# EAGLE design biggity (EAGLE 9.1.1)
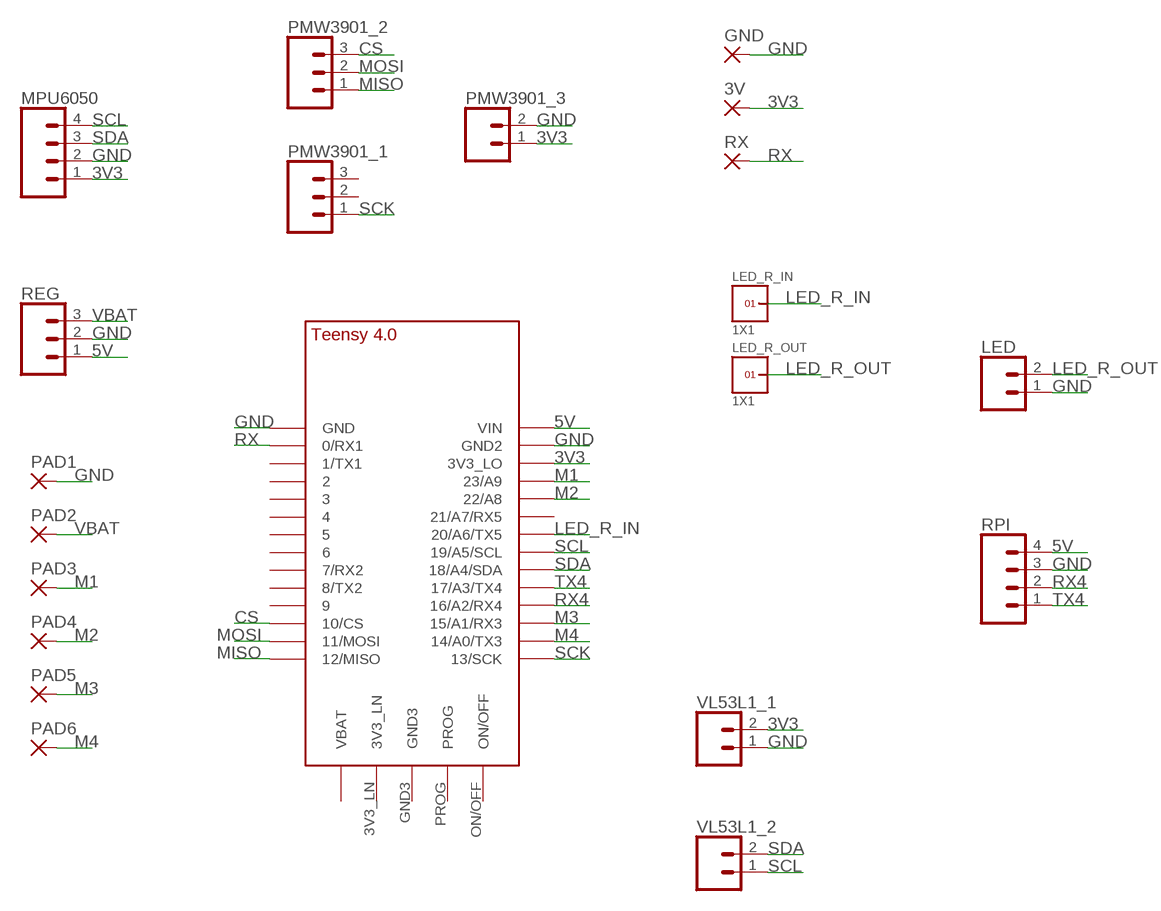
[diagram p0: schematic, sheet 1]

## Parts
3V  SMD2  [SMD1,27-2,54]
GND  SMD2  [SMD1,27-2,54]
LED  CONN_021X02_NO_SILK  [1X02_NO_SILK]
LED_R_IN  1X1  [1X1]
LED_R_OUT  1X1  [1X1]
MPU6050  CONN_041X04_NO_SILK  [1X04_NO_SILK]
PAD1  SMD2  [SMD1,27-2,54]
PAD2  SMD2  [SMD1,27-2,54]
PAD3  SMD2  [SMD1,27-2,54]
PAD4  SMD2  [SMD1,27-2,54]
PAD5  SMD2  [SMD1,27-2,54]
PAD6  SMD2  [SMD1,27-2,54]
PMW3901_1  CONN_031X03_NO_SILK  [1X03_NO_SILK]
PMW3901_2  CONN_031X03_NO_SILK  [1X03_NO_SILK]
PMW3901_3  CONN_021X02_NO_SILK  [1X02_NO_SILK]
REG  CONN_031X03_NO_SILK  [1X03_NO_SILK]
RPI  CONN_041X04_NO_SILK  [1X04_NO_SILK]
RX  SMD2  [SMD1,27-2,54]
U$1  TEENSY_4.0  [TEENSY_4.0]
VL53L1_1  CONN_021X02_NO_SILK  [1X02_NO_SILK]
VL53L1_2  CONN_021X02_NO_SILK  [1X02_NO_SILK]

## Nets
3V3: 3V.1(P) MPU6050.1 PMW3901_3.1 U$1.3V3_LO VL53L1_1.2
5V: REG.1 RPI.4 U$1.VIN
CS: PMW3901_2.3 U$1.10/CS
GND: GND.1(P) LED.1 MPU6050.2 PAD1.1(P) PMW3901_3.2 REG.2 RPI.3 U$1.GND U$1.GND2 VL53L1_1.1
LED_R_IN: LED_R_IN.1 U$1.20/A6(20/A6/TX5)
LED_R_OUT: LED.2 LED_R_OUT.1
M1: PAD3.1(P) U$1.23/A9
M2: PAD4.1(P) U$1.22/A8
M3: PAD5.1(P) U$1.15/A1(15/A1/RX3)
M4: PAD6.1(P) U$1.14/A0(14/A0/TX3)
MISO: PMW3901_2.1 U$1.12/MISO
MOSI: PMW3901_2.2 U$1.11/MOSI
RX: RX.1(P) U$1.0/RX(0/RX1)
RX4: RPI.2 U$1.16/A2(16/A2/RX4)
SCK: PMW3901_1.1 U$1.13/SCK
SCL: MPU6050.4 U$1.19/A5/SCL VL53L1_2.1
SDA: MPU6050.3 U$1.18/A4/SDA VL53L1_2.2
TX4: RPI.1 U$1.17/A3(17/A3/TX4)
VBAT: PAD2.1(P) REG.3
Unconnected: PMW3901_1.2 PMW3901_1.3 U$1.1/TX(1/TX1) U$1.2 U$1.3/CANTX U$1.3V3_LN U$1.4/CANRX U$1.5 U$1.6 U$1.7(7/RX2) U$1.8(8/TX2) U$1.9/CS U$1.21/A7(21/A7/RX5) U$1.GND3 U$1.ON/OFF U$1.PROG U$1.VBAT\(VBAT)

## Library data of the parts
3V GND PAD1-PAD6 RX = wirepad:SMD2: SMD PAD
LED PMW3901_3 VL53L1_1 VL53L1_2 = SparkFun-Connectors:CONN_02: Multi connection point. Often used as Generic Header-pin footprint for 0.1 inch spaced/style header connections On any of the 0.1 inch spaced packages, you can populate with these: Break Away Headers - Straight <https://www.sparkfun.com/products/116> (PRT-00116) Break Away Male Headers - Right Angle <https://www.sparkfun.com/products/553> (PRT-00553) Female Headers <https://www.sparkfun.com/products/115> (PRT-00115) Break Away Headers - Machine Pin <https://www.sparkfun.com/products/117> (PRT-00117) Break Away Female Headers - Swiss Machine Pin <https://www.sparkfun.com/products/743> (PRT-00743) For SCREWTERMINALS and SPRING TERMINALS visit here: Screw Terimnals on SparkFun.com <https://www.sparkfun.com/search/results?term=Screw+Terminals> (5mm/3.5mm/2.54mm spacing) This device is also useful as a general connection point to wire up your design to another part of your project. Our various solder wires solder well into these plated through hole pads. Hook-Up Wire - Assortment (Stranded, 22 AWG) <https://www.sparkfun.com/products/11375> (PRT-11375) Hook-Up Wire - Assortment (Solid Core, 22 AWG) <https://www.sparkfun.com/products/11367> (PRT-11367) View the entire wire category on our website here <https://www.sparkfun.com/categories/141> Special notes: Molex polarized connector foot print use with: PRT-08233 with associated crimp pins and housings. 2.54_SCREWTERM for use with PRT-10571. 3.5mm Screw Terminal footprints for PRT-08084 5mm Screw Terminal footprints for use with PRT-08432
LED_R_IN LED_R_OUT = headers(2mm):1X1
MPU6050 RPI = SparkFun-Connectors:CONN_04: Multi connection point. Often used as Generic Header-pin footprint for 0.1 inch spaced/style header connections On any of the 0.1 inch spaced packages, you can populate with these: Break Away Headers - Straight <https://www.sparkfun.com/products/116> (PRT-00116) Break Away Male Headers - Right Angle <https://www.sparkfun.com/products/553> (PRT-00553) Female Headers <https://www.sparkfun.com/products/115> (PRT-00115) Break Away Headers - Machine Pin <https://www.sparkfun.com/products/117> (PRT-00117) Break Away Female Headers - Swiss Machine Pin <https://www.sparkfun.com/products/743> (PRT-00743) For SCREWTERMINALS and SPRING TERMINALS visit here: Screw Terimnals on SparkFun.com <https://www.sparkfun.com/search/results?term=Screw+Terminals> (5mm/3.5mm/2.54mm spacing) This device is also useful as a general connection point to wire up your design to another part of your project. Our various solder wires solder well into these plated through hole pads. Hook-Up Wire - Assortment (Stranded, 22 AWG) <https://www.sparkfun.com/products/11375> (PRT-11375) Hook-Up Wire - Assortment (Solid Core, 22 AWG) <https://www.sparkfun.com/products/11367> (PRT-11367) View the entire wire category on our website here <https://www.sparkfun.com/categories/141> Special notes: Molex polarized connector foot print use with SKU : PRT-08231 with associated crimp pins and housings. 1MM SMD Version SKU: PRT-10208; PROD_ID: CONN-09696
PMW3901_1 PMW3901_2 REG = SparkFun-Connectors:CONN_03: Multi connection point. Often used as Generic Header-pin footprint for 0.1 inch spaced/style header connections On any of the 0.1 inch spaced packages, you can populate with these: Break Away Headers - Straight <https://www.sparkfun.com/products/116> (PRT-00116) Break Away Male Headers - Right Angle <https://www.sparkfun.com/products/553> (PRT-00553) Female Headers <https://www.sparkfun.com/products/115> (PRT-00115) Break Away Headers - Machine Pin <https://www.sparkfun.com/products/117> (PRT-00117) Break Away Female Headers - Swiss Machine Pin <https://www.sparkfun.com/products/743> (PRT-00743) Stackable Header - 3 Pin (Female, 0.1") <https://www.sparkfun.com/products/13875> (PRT-13875) For SCREWTERMINALS and SPRING TERMINALS visit here: Screw Terimnals on SparkFun.com <https://www.sparkfun.com/search/results?term=Screw+Terminals> (5mm/3.5mm/2.54mm spacing) This device is also useful as a general connection point to wire up your design to another part of your project. Our various solder wires solder well into these plated through hole pads. Hook-Up Wire - Assortment (Stranded, 22 AWG) <https://www.sparkfun.com/products/11375> (PRT-11375) Hook-Up Wire - Assortment (Solid Core, 22 AWG) <https://www.sparkfun.com/products/11367> (PRT-11367) View the entire wire category on our website here <https://www.sparkfun.com/categories/141> Special notes: Molex polarized connector foot print use with SKU : PRT-08232 with associated crimp pins and housings.
U$1 = TEENSY 4.0:TEENSY_4.0

## Board
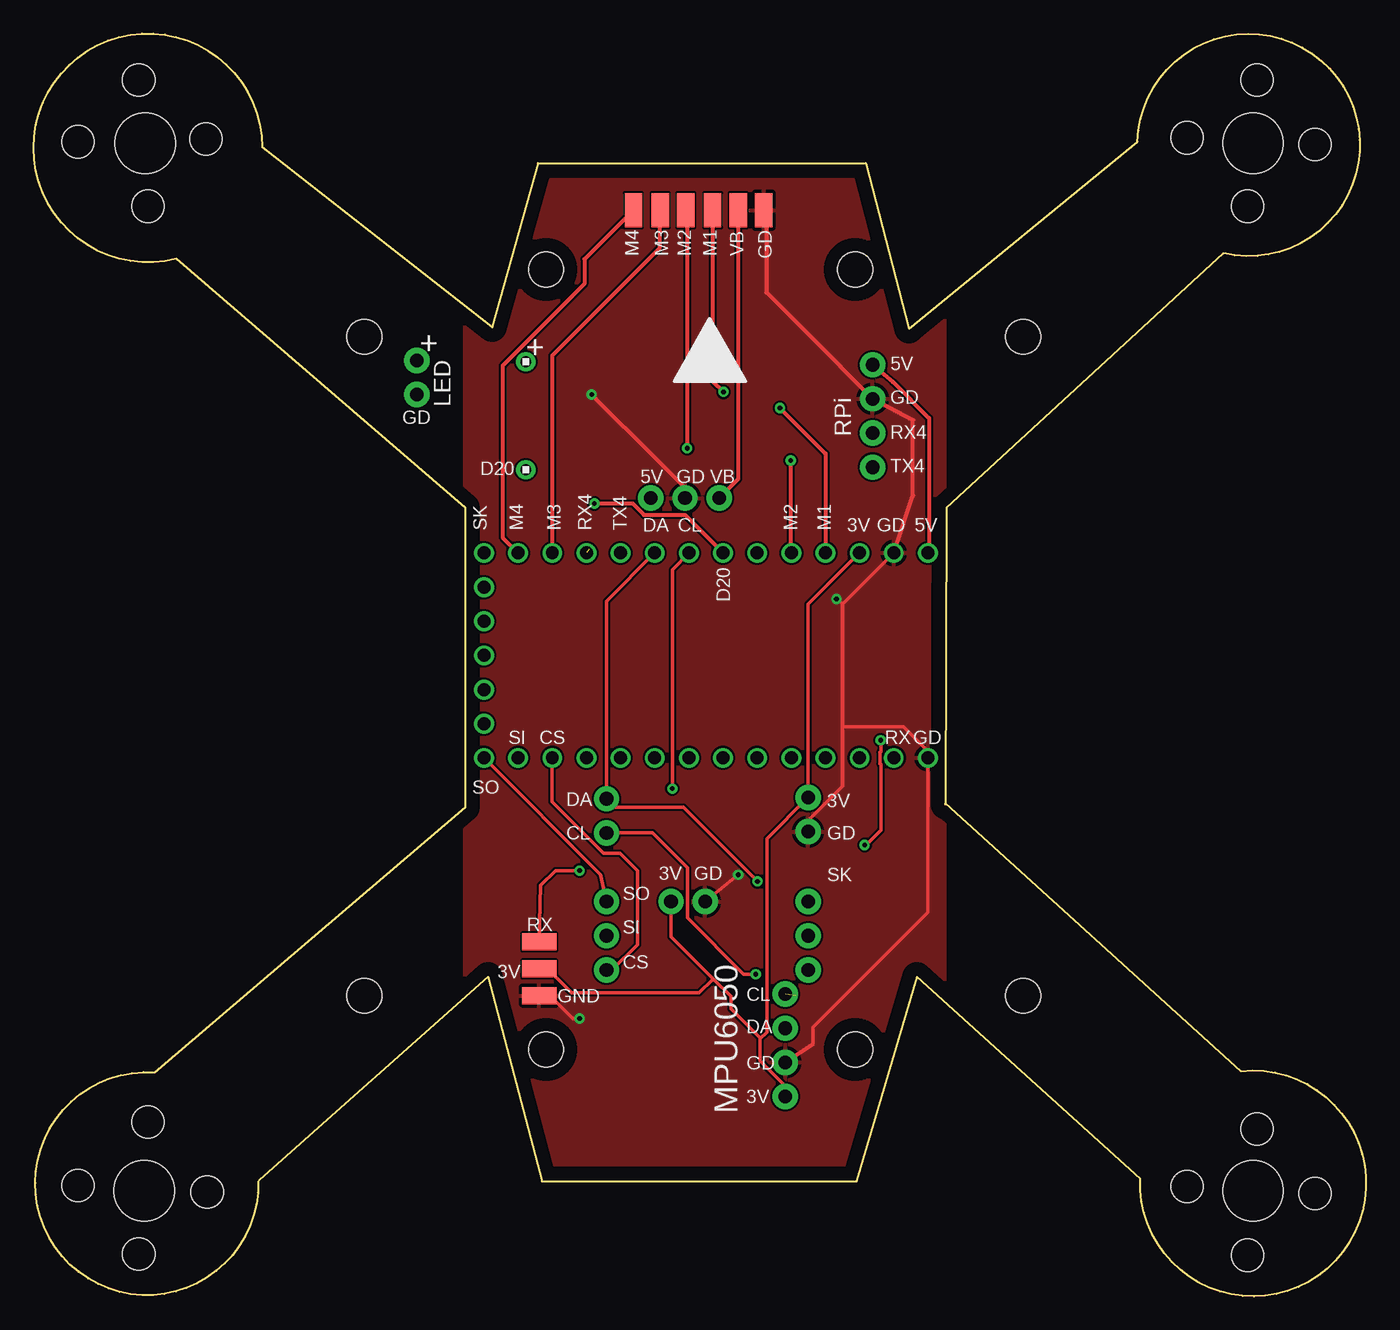
[diagram p1: board, top side]
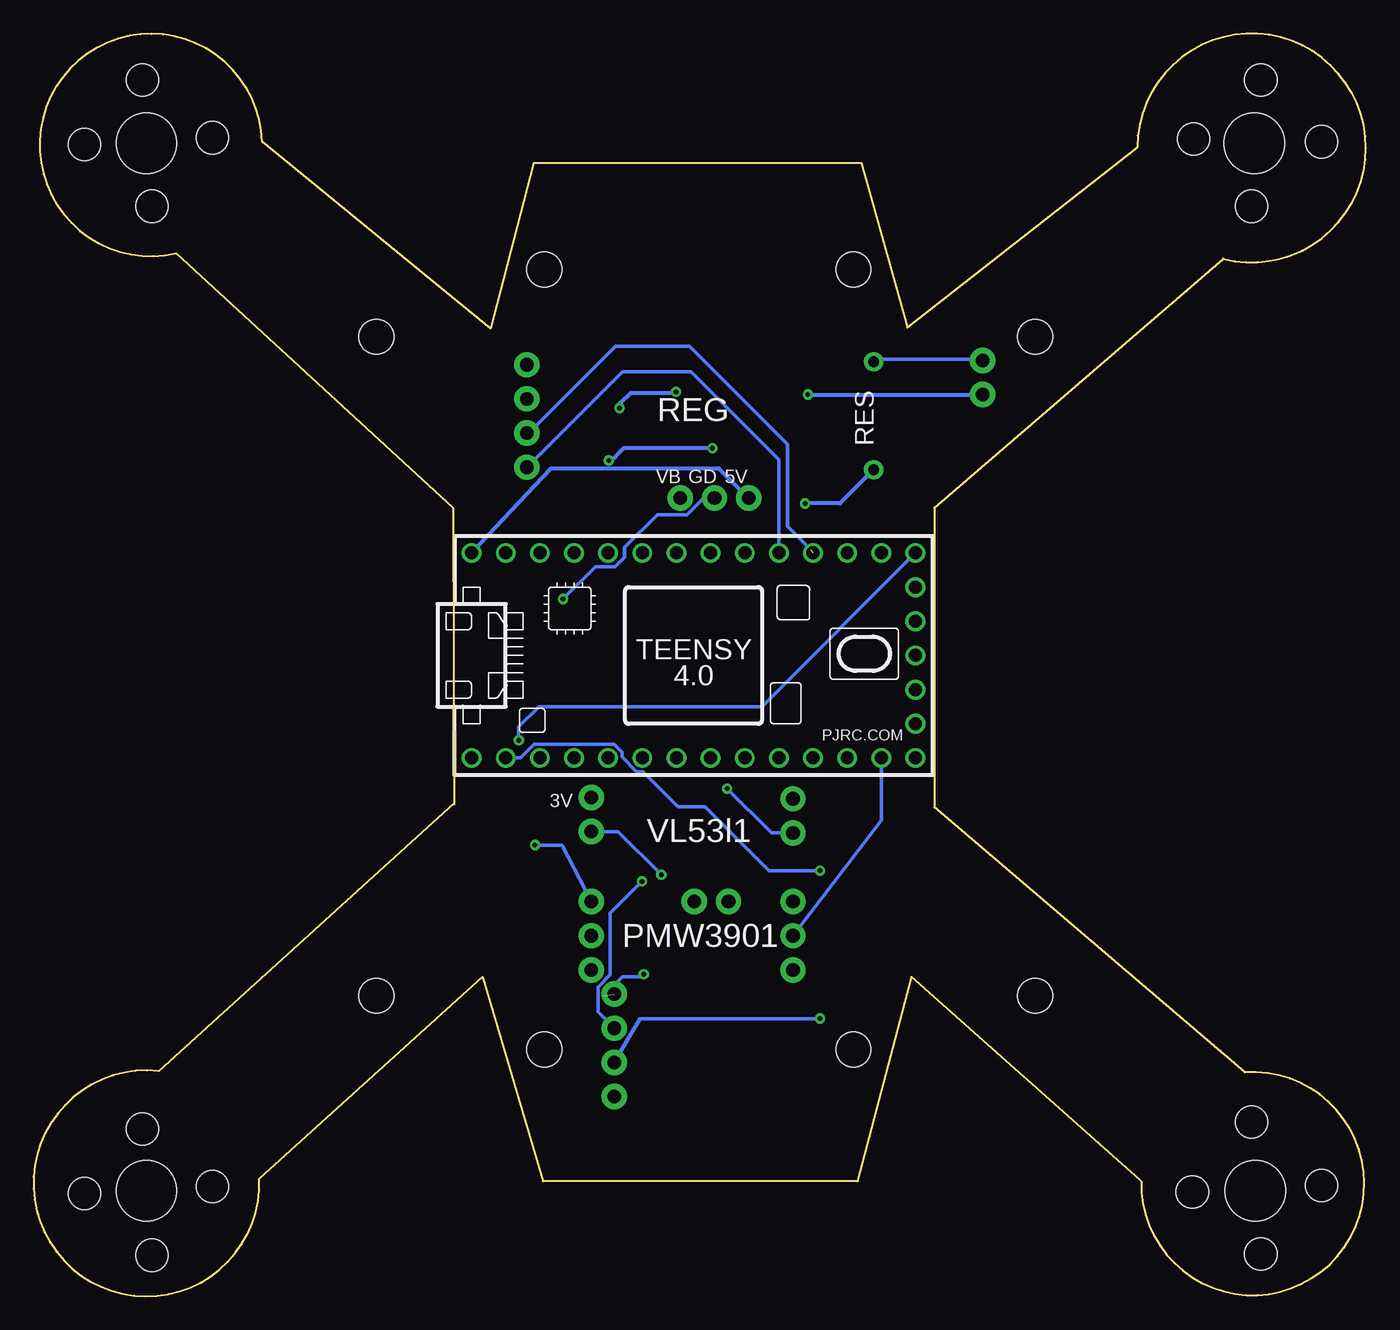
[diagram p2: board, bottom side, seen from below]

Size 99.1 x 93.9 mm. Coordinates in mm from the lower left corner, seen from the top.
Outline: 67.81,36.56 67.91,58.66 88.51,77.56 arc281 82.11,85.86 65.11,71.96 61.91,84.26 37.51,84.26 34.11,72.06 17.01,85.46 arc284 10.61,77.16 32.11,58.66 32.11,36.36 9.01,16.66 arc275 16.71,8.56
Outline: 16.81,8.66 33.81,23.76 37.81,8.56 61.21,8.56 65.71,23.76 82.31,8.76 arc279 89.81,16.76 67.81,36.66
Copper layers (1*16): Top 0.035mm / dielectric 1.5mm / Bottom 0.035mm
Design rules "default": minimum track width 6mil, minimum drill 0.35mm, track to track 6mil, track to pad 6mil, pad to pad 6mil, via to via 6mil, smd to smd 6mil, copper to edge 40mil, drill to drill 6mil, minimum pad ring 10mil, minimum via ring 8mil, stop-mask expansion 4mil, vias tented up to drill 0mil, thermal gap 10mil
Holes 4.5 mm at 90.71,85.76 8.21,7.86 8.31,85.76 90.71,7.86
Holes 2.4 mm at 91.01,90.46 90.31,81.06 85.81,86.16 95.31,85.66 7.81,90.46 8.51,81.06 3.31,85.86 12.81,86.06 91.01,12.46 90.31,3.06 85.81,8.16 95.31,7.66 8.51,12.96 7.81,3.16 3.31,8.26 12.91,7.76
Holes 2.6 mm at 24.61,71.36 73.61,71.36 73.61,22.36 24.61,22.36 38.11,76.36 61.11,76.36 38.11,18.36 61.11,18.36

### Footprints (pad centres in the part's own frame; a part is rotated, then mirrored left to right if it is on the bottom)
SMD1,27-2,54 = smd 1.27 x 2.54: 1 0,0
1X02_NO_SILK = drill 1.016 pad 1.88: 1 0,0; 2 2.54,0
1X1 = drill 0.8 pad 1.422: 1 0,0
1X04_NO_SILK = drill 1.016 pad 1.88: 1 0,0; 2 2.54,0; 3 5.08,0; 4 7.62,0
1X03_NO_SILK = drill 1.016 pad 1.88: 1 0,0; 2 2.54,0; 3 5.08,0
TEENSY_4.0 = drill 0.965: 0/RX -13.97,-7.62; 1/TX -11.43,-7.62; 2 -8.89,-7.62; 3/CANTX -6.35,-7.62; 3V3_LN 16.51,-2.54; 3V3_LO -11.43,7.62; 4/CANRX -3.81,-7.62; 5 -1.27,-7.62; 6 1.27,-7.62; 7 3.81,-7.62; 8 6.35,-7.62; 9/CS 8.89,-7.62; 10/CS 11.43,-7.62; 11/MOSI 13.97,-7.62; 12/MISO 16.51,-7.62; 13/SCK 16.51,7.62; 14/A0 13.97,7.62; 15/A1 11.43,7.62; 16/A2 8.89,7.62; 17/A3 6.35,7.62; 18/A4/SDA 3.81,7.62; 19/A5/SCL 1.27,7.62; 20/A6 -1.27,7.62; 21/A7 -3.81,7.62; 22/A8 -6.35,7.62; 23/A9 -8.89,7.62; GND -16.51,-7.62; GND2 -13.97,7.62; GND3 16.51,0; ON/OFF 16.51,5.08; PROG 16.51,2.54; VBAT\ 16.51,-5.08; VIN -16.51,7.62

### Placement (x,y rotation side)
3V  37.61,24.36 90 top
GND  37.61,22.36 90 top
LED  28.51,67.06 90 top
LED_R_IN  36.61,61.46 0 top
LED_R_OUT  36.61,69.49 0 top
MPU6050  55.91,14.86 90 top
PAD1  54.31,80.76 0 top
PAD2  52.41,80.76 0 top
PAD3  50.51,80.76 0 top
PAD4  48.51,80.76 0 top
PAD5  46.61,80.76 0 top
PAD6  44.61,80.76 0 top
PMW3901_1  57.61,29.36 270 top
PMW3901_2  42.61,29.36 270 top
PMW3901_3  47.41,29.36 0 top
REG  45.91,59.36 0 top
RPI  62.41,61.66 90 top
RX  37.61,26.36 90 top
U$1  50.01,47.66 0 bottom
VL53L1_1  57.61,34.56 90 top
VL53L1_2  42.61,34.46 90 top

### Tracks (layer width: path | path; a pad name or v marks a point on that pad's centre or on a via)
3V3
  Top 0.254: U$1.3V3_LO 57.61,51.45 VL53L1_1.2 54.54,34.02 54.54,19.66 54.04,19.16 | 54.04,17.53 56.71,14.86 MPU6050.1 | PMW3901_3.1 47.41,26.75 50.01,24.15 50.61,23.56 | 50.61,23.56 51.86,22.3 51.86,21.4 54.04,19.23 54.04,19.16 | 54.04,17.93 54.04,17.53 | 50.61,23.56 50.51,23.56 49.51,22.56 40.01,22.56 38.21,24.36 3V.1 | 54.04,19.16 54.04,17.53
5V
  Top 0.305: RPI.4 63.91,68 66.61,65.3 66.61,55.36 U$1.VIN
  Bottom 0.305: REG.1 48.11,61.56 60.63,61.56 U$1.VIN
CS
  Top 0.254: U$1.10/CS 38.58,37.16 38.58,36.76 42.41,32.94 43.63,32.94 44.91,31.66 44.91,26.16 43.03,24.28 PMW3901_2.3
GND  (via drill 0.35)
  Top 0.254: 60.15,51.45 U$1.GND2 63.71,55.55 | 60.15,51.45 60.15,42.36 | 60.15,42.36 60.15,37.91 57.61,35.37 VL53L1_1.1 57.82,34.35 | 60.15,42.36 64.71,42.36 66.61,40.46 | v52.41,31.36 PMW3901_3.2 | 60.15,51.45 59.74,51.86 v59.71,51.86 | v40.61,20.66 40.11,20.66 38.31,22.46 | U$1.GND 66.52,28.57 57.97,20.01 57.97,18.75 MPU6050.2
  Top 0.305: PAD1.1 54.51,80.56 54.51,74.66 60.01,69.16 60.03,69.12 RPI.3 65.41,65.16 65.41,59.56 U$1.GND2 | REG.2 48.45,60.12 46.41,62.16 v41.51,67.06
  Bottom 0.254: v52.41,31.36 55.61,34.56 VL53L1_1.1 57.11,34.06 | v59.71,51.86 57.31,54.26 55.84,54.26 55.15,54.96 55.15,55.7 52.71,58.14 50.49,58.14 49.27,59.36 REG.2 | MPU6050.2 54.01,20.66 v40.61,20.66
  Bottom 0.305: v41.51,67.06 LED.1
  pour Top: 67.76,91.11 67.76,7.11 32.11,7.11 32.11,91.11
LED_R_IN  (via drill 0.35)
  Top 0.305: U$1.20/A6 48.45,58.11 45.4,58.11 44.55,58.96 v41.71,58.96
  Bottom 0.305: LED_R_IN.1 39.11,58.96 v41.71,58.96
LED_R_OUT
  Bottom 0.254: LED_R_OUT.1 36.4,69.7 28.4,69.7
  Bottom 0.305: 28.4,69.7 28.42,69.69 LED.2
M1  (via drill 0.35)
  Top 0.305: PAD3.1 50.51,68.06 v51.31,67.26 | v55.51,66.06 58.9,62.67 U$1.23/A9
  Bottom 0.305: v51.31,67.26 51.41,67.16 54.71,67.16 55.51,66.36 v55.51,66.06
M2  (via drill 0.35)
  Top 0.305: PAD4.1 48.61,80.66 v48.61,63.06 | v56.31,62.16 56.31,55.33 U$1.22/A8
  Bottom 0.305: v48.61,63.06 55.21,63.06 56.31,61.96 v56.31,62.16
M3
  Top 0.305: PAD5.1 46.55,80.7 46.55,77.92 38.58,69.95 U$1.15/A1
M4  (via drill 0.35)
  Top 0.305: PAD6.1 40.98,77.13 40.98,75.29 34.9,69.21 34.9,56.42 U$1.14/A0
  other vias: 36.04,55.28
MISO
  Top 0.254: U$1.12/MISO 42.18,31.36 PMW3901_2.1
MOSI
  Bottom 0.254: U$1.11/MOSI 36.04,35.39 PMW3901_2.2
RX  (via drill 0.35)
  Top 0.254: v40.61,31.66 38.81,31.66 37.71,30.56 RX.1
  Bottom 0.254: U$1.0/RX 62.88,40.04 61.86,41.05 55.94,41.05 55.35,40.46 55.35,40.12 54.24,39.02 53.78,39.02 51.17,36.42 49.17,36.42 44.41,31.66 v40.61,31.66
RX4  (1 unrouted)
  Bottom 0.254: 41.31,55.56 43.01,57.26 43.01,63.36 50.31,70.66 55.81,70.66 62.27,64.2 RPI.2
SCK  (via drill 0.35)
  Top 0.254: v63.01,41.36 63.01,40.5 62.97,40.46 62.97,39.62 63.01,39.57 63.01,34.66 61.91,33.56 v61.81,33.56
  Bottom 0.254: U$1.13/SCK 44.92,43.86 61.51,43.86 63.01,42.36 v63.01,41.36 | v61.81,33.56 59.81,33.56 PMW3901_1.1
SCL  (via drill 0.35)  (1 unrouted)
  Top 0.254: 42.11,34.46 VL53L1_2.1 46.04,34.46 48.63,31.86 48.63,28.14 52.81,23.96 v53.71,23.96 | U$1.19/A5/SCL 47.51,54.05 v47.51,37.76
  Bottom 0.254: v47.51,37.76 44.21,34.46 VL53L1_2.1 | v53.71,23.96 53.91,23.76 55.29,23.76 56.69,22.36
SDA  (via drill 0.35)
  Top 0.254: U$1.18/A4/SDA 42.61,51.69 VL53L1_2.2 43.25,36.36 48.34,36.36 v53.84,30.86 53.91,30.86
  Bottom 0.254: v53.84,30.86 56.21,28.49 56.21,23.9 57.13,22.98 57.13,21.16 MPU6050.3
  other vias: 55.91,19.94
TX4
  Bottom 0.254: RPI.1 55.31,68.76 50.21,68.76 43.66,62.21 U$1.17/A3
VBAT
  Top 0.305: PAD2.1 52.41,60.78 REG.3

### Text on the board
tNames: M4 | M3 | M2 | M1 | VB | GD | + | + | 5V | LED | GD | GD | RPi | RX4 | D20 | TX4 | 5V | GD | VB | SK | M4 | M3 | RX4 | TX4 | DA | CL | M2 | M1 | 3V | GD | 5V | D20 | SI | CS | RX | GD | SO | DA | 3V | CL | GD | 3V | GD | SK | SO | SI | MPU6050 | CS | CL | DA | GD | 3V
bNames: REG | RES | 5V | GD | VB | 3V | VL53l1 | PMW3901